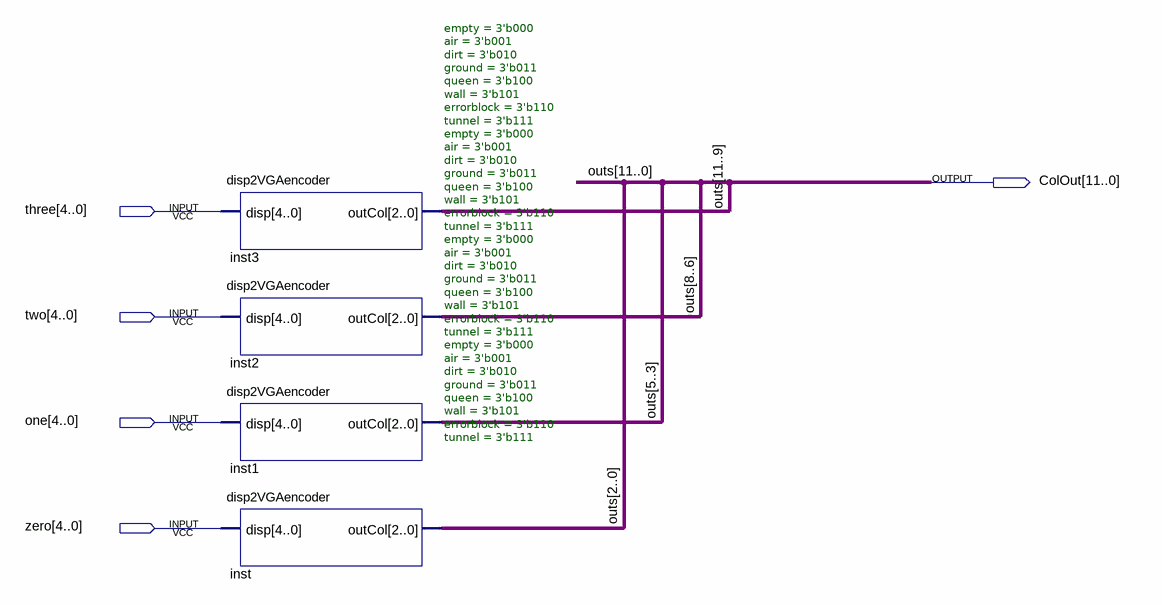
[diagram p0: schematic sheet]
// Quartus schematic columnencoderV2.bdf as structural Verilog: 4 symbols, 5 pins
module columnencoderV2 (
  input  [4:0] three,
  input  [4:0] two,
  input  [4:0] one,
  input  [4:0] zero,
  output [11:0] ColOut
);

  disp2VGAencoder #(.empty(3'b000), .air(3'b001), .dirt(3'b010), .ground(3'b011), .queen(3'b100), .wall(3'b101), .errorblock(3'b110), .tunnel(3'b111)) inst3 (
    .disp(three), .outCol(ColOut[11:9]));
  disp2VGAencoder #(.empty(3'b000), .air(3'b001), .dirt(3'b010), .ground(3'b011), .queen(3'b100), .wall(3'b101), .errorblock(3'b110), .tunnel(3'b111)) inst2 (
    .disp(two), .outCol(ColOut[8:6]));
  disp2VGAencoder #(.empty(3'b000), .air(3'b001), .dirt(3'b010), .ground(3'b011), .queen(3'b100), .wall(3'b101), .errorblock(3'b110), .tunnel(3'b111)) inst1 (
    .disp(one), .outCol(ColOut[5:3]));
  disp2VGAencoder #(.empty(3'b000), .air(3'b001), .dirt(3'b010), .ground(3'b011), .queen(3'b100), .wall(3'b101), .errorblock(3'b110), .tunnel(3'b111)) inst (
    .disp(zero), .outCol(ColOut[2:0]));

  // Other names for the same wires on the sheet: outs[11:0] = ColOut
endmodule
